# EAGLE schematic TestBoard (EAGLE 9.1.3)
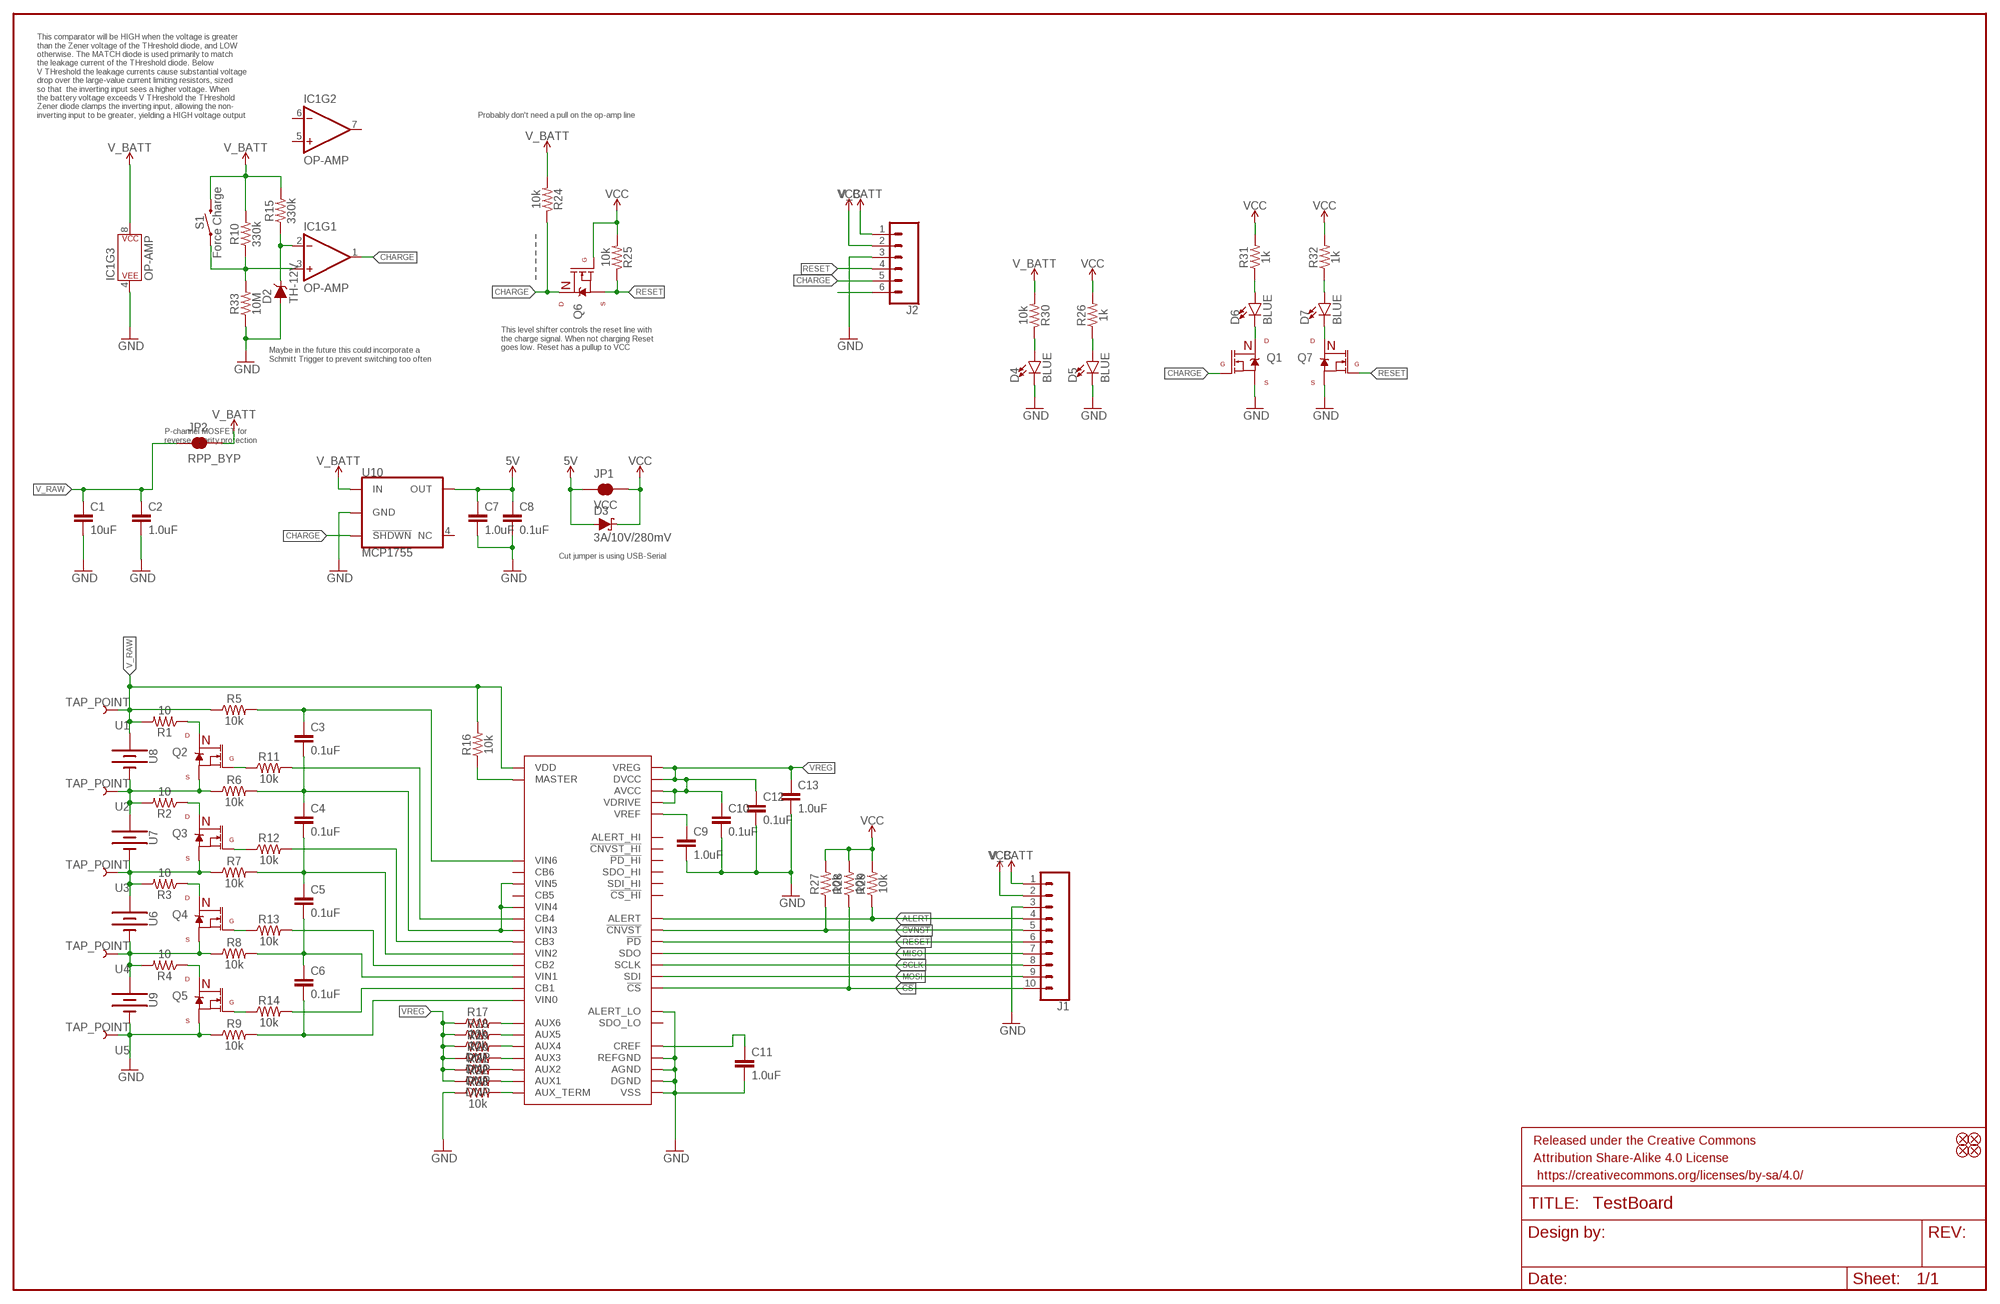
[diagram p0: schematic, sheet 1]

## Parts
C1  10uF  10UF-1210-50V-20%  [1210]
C2  1.0uF  1.0UF-1206-50V-10%  [1206]
C3  0.1uF  0.1UF-0603-25V-5%  [0603]
C4  0.1uF  0.1UF-0603-25V-5%  [0603]
C5  0.1uF  0.1UF-0603-25V-5%  [0603]
C6  0.1uF  0.1UF-0603-25V-5%  [0603]
C7  1.0uF  1.0UF-0603-16V-10%-X7R  [0603]
C8  0.1uF  0.1UF-0603-25V-5%  [0603]
C9  1.0uF  1.0UF-0603-16V-10%-X7R  [0603]
C10  0.1uF  0.1UF-0603-25V-5%  [0603]
C11  1.0uF  1.0UF-0603-16V-10%-X7R  [0603]
C12  0.1uF  0.1UF-0603-25V-5%  [0603]
C13  1.0uF  1.0UF-0603-16V-10%-X7R  [0603]
D2  TH-12V  DIODE-ZENER-MMBZ5233BLT1G  [SOT23-3]
D3  3A/10V/280mV  DIODE-SCHOTTKY-BAT60A  [SOD-323]
D4  BLUE  LED-BLUE0603  [LED-0603]
D5  BLUE  LED-BLUE0603  [LED-0603]
D6  BLUE  LED-BLUE0603  [LED-0603]
D7  BLUE  LED-BLUE0603  [LED-0603]
FD1  FIDUCIALUFIDUCIAL  [FIDUCIAL-MICRO]
FD2  FIDUCIALUFIDUCIAL  [FIDUCIAL-MICRO]
FD3  FIDUCIALUFIDUCIAL  [FIDUCIAL-MICRO]
FD4  FIDUCIALUFIDUCIAL  [FIDUCIAL-MICRO]
FRAME1  FRAME-LEDGER  [CREATIVE_COMMONS]
IC1  OP-AMP  OPAMP-DUALU  [SO08]
J1  CONN_10NO_SILK_PTH_FEMALE  [1X10_NO_SILK]
J2  CONN_06NO_SILK_NO_POP  [1X06_NO_SILK]
JP1  VCC  JUMPER-SMT_2_NC_TRACE_SILK  [SMT-JUMPER_2_NC_TRACE_SILK]
JP2  RPP_BYP  JUMPER-SMT_2_NC_TRACE_SILK  [SMT-JUMPER_2_NC_TRACE_SILK]
Q1  AMP_MOSFET_NCH-2N7002K  [SOT23-3]
Q2  AMP_MOSFET_NCH-2N7002K  [SOT23-3]
Q3  AMP_MOSFET_NCH-2N7002K  [SOT23-3]
Q4  AMP_MOSFET_NCH-2N7002K  [SOT23-3]
Q5  AMP_MOSFET_NCH-2N7002K  [SOT23-3]
Q6  AMP_MOSFET_NCH-2N7002K  [SOT23-3]
Q7  AMP_MOSFET_NCH-2N7002K  [SOT23-3]
R1  10  10OHM-1206-1/4W-1%  [1206]
R2  10  10OHM-1206-1/4W-1%  [1206]
R3  10  10OHM-1206-1/4W-1%  [1206]
R4  10  10OHM-1206-1/4W-1%  [1206]
R5  10k  10KOHM-0603-1/10W-1%  [0603]
R6  10k  10KOHM-0603-1/10W-1%  [0603]
R7  10k  10KOHM-0603-1/10W-1%  [0603]
R8  10k  10KOHM-0603-1/10W-1%  [0603]
R9  10k  10KOHM-0603-1/10W-1%  [0603]
R10  330k  330KOHM-0603-1/10W-1%  [0603]
R11  10k  10KOHM-0603-1/10W-1%  [0603]
R12  10k  10KOHM-0603-1/10W-1%  [0603]
R13  10k  10KOHM-0603-1/10W-1%  [0603]
R14  10k  10KOHM-0603-1/10W-1%  [0603]
R15  330k  330KOHM-0603-1/10W-1%  [0603]
R16  10k  10KOHM-0603-1/10W-1%  [0603]
R17  10k  10KOHM-0603-1/10W-1%  [0603]
R18  10k  10KOHM-0603-1/10W-1%  [0603]
R19  DNP  NTC_STOP_ONE_SIDE  [AXIAL-0.3]
R20  DNP  NTC_STOP_ONE_SIDE  [AXIAL-0.3]
R21  DNP  NTC_STOP_ONE_SIDE  [AXIAL-0.3]
R22  DNP  NTC_STOP_ONE_SIDE  [AXIAL-0.3]
R23  10k  10KOHM-0603-1/10W-1%  [0603]
R24  10k  10KOHM-0603-1/10W-1%  [0603]
R25  10k  10KOHM-0603-1/10W-1%  [0603]
R26  1k  1KOHM-0603-1/10W-1%  [0603]
R27  10k  10KOHM-0603-1/10W-1%  [0603]
R28  10k  10KOHM-0603-1/10W-1%  [0603]
R29  10k  10KOHM-0603-1/10W-1%  [0603]
R30  10k  10KOHM-0603-1/10W-1%  [0603]
R31  1k  1KOHM-0603-1/10W-1%  [0603]
R32  1k  1KOHM-0603-1/10W-1%  [0603]
R33  10M  10MOHM-0603-1/10W-5%  [0603]
S1  Force Charge  MOMENTARY-SWITCH-SPST-SMD-5.2-TALL-REDUNDANT  [TACTILE_SWITCH_SMD_5.2MM]
U1  TAP_POINT  [1X01_SMD_0.1IN]
U2  TAP_POINT  [1X01_SMD_0.1IN]
U3  TAP_POINT  [1X01_SMD_0.1IN]
U4  TAP_POINT  [1X01_SMD_0.1IN]
U5  TAP_POINT  [1X01_SMD_0.1IN]
U6  SINGLECELL  (no package)
U7  SINGLECELL  (no package)
U8  SINGLECELL  (no package)
U9  SINGLECELL  (no package)
U10  MCP1755  [SOT23-5]
U11  AD7280A  [LQFP-48]

## Nets
5V: C7.1 C8.1 D3.A JP1.1 U10.5(OUT)
!CS: J1.10 R28.1 U11.21(!CS)
!CVNST: J1.5 R27.1 U11.24(!CNVST)
ALERT: J1.4 R29.1 U11.27(ALERT)
CHARGE: IC1.1(OUT) J2.5 Q1.1(G) Q6.3(D) R24.1 U10.3(!SHDWN)
GND: C1.2 C2.2 C7.2 C8.2 C9.2 C10.2 C11.2 C12.2 C13.2 D2.1(A) D4.C D5.C IC1.4(P$V-) J1.3 J2.3 Q1.2(S) Q5.2(S) Q7.2(S) R9.1 R23.1 R33.1 U5.1 U9.- U10.2(GND) U11.17(VSS) U11.20(DGND) U11.28(ALERT_LO) U11.31(AGND) U11.41(REFGND)
MISO: J1.7 U11.26(SDO)
MOSI: J1.9 U11.23(SDI)
N$2: D7.C Q7.3(D)
N$3: D6.C Q1.3(D)
N$5: Q2.3(D) R1.1
N$6: Q2.2(S) R2.2 R6.1 U2.1 U7.+ U8.-
N$7: Q3.3(D) R2.1
N$8: Q3.2(S) R3.2 R7.1 U3.1 U6.+ U7.-
N$9: Q4.3(D) R3.1
N$10: Q4.2(S) R4.2 R8.1 U4.1 U6.- U9.+
N$11: Q5.3(D) R4.1
N$12: Q2.1(G) R11.1
N$13: Q3.1(G) R12.1
N$14: R16.1 U11.14(MASTER)
N$15: Q4.1(G) R13.1
N$16: Q5.1(G) R14.1
N$17: C6.2 R9.2 U11.13(VIN0)
N$18: R14.2 U11.12(CB1)
N$19: C5.2 C6.1 R8.2 U11.11(VIN1)
N$20: R13.2 U11.10(CB2)
N$21: C4.2 C5.1 R7.2 U11.9(VIN2)
N$22: R12.2 U11.8(CB3)
N$23: R22.P$2 U11.38(AUX1)
N$24: R11.2 U11.6(CB4)
N$25: C3.1 R5.2 U11.1(VIN6)
N$26: C3.2 C4.1 R6.2 U11.3(VIN5) U11.5(VIN4) U11.7(VIN3)
N$27: C9.1 U11.40(VREF)
N$28: R17.2 U11.33(AUX6)
N$29: C11.1 U11.39(CREF)
N$30: R23.2 U11.32(AUX_TERM)
N$31: R18.2 U11.34(AUX5)
N$32: R21.P$2 U11.37(AUX2)
N$33: R20.P$2 U11.36(AUX3)
N$34: R19.P$2 U11.35(AUX4)
N$35: D4.A R30.1
N$36: J2.6
N$37: D5.A R26.1
N$38: D6.A R31.1
N$39: D7.A R32.1
N$40: IC1.3(+IN) R10.1 R33.2 S1.1 S1.2
N$41: D2.3(C) IC1.2(-IN) R15.1
RESET: J1.6 J2.4 Q6.2(S) Q7.1(G) R25.1 U11.15(!PD)
SCLK: J1.8 U11.22(SCLK)
V_BATT: IC1.8(P$V+) J1.1 J2.1 JP2.2 R10.2 R15.2 R24.2 R30.2 S1.3 S1.4 U10.1(IN)
V_RAW: C1.1 C2.1 JP2.1 R1.2 R5.1 R16.2 U1.1 U8.+ U11.16(VDD)
VCC: D3.C J1.2 J2.2 JP1.2 Q6.1(G) R25.2 R26.2 R27.2 R28.2 R29.2 R31.2 R32.2
VREG: C10.1 C12.1 C13.1 R17.1 R18.1 R19.P$1 R20.P$1 R21.P$1 R22.P$1 U11.18(VREG) U11.19(DVCC) U11.29(VDRIVE) U11.30(AVCC)
Unconnected: IC1.5(+IN) IC1.6(-IN) IC1.7(OUT) U10.4(NC) U11.2(CB6) U11.4(CB5) U11.25(SDO_LO) U11.42(ALERT_HI) U11.43(SDI_HI) U11.44(!CNVST_HI) U11.45(SDO_HI) U11.46(!CS_HI) U11.47(!PD_HI)

## Notes on the sheet
- This comparator will be HIGH when the voltage is greater
  than the Zener voltage of the THreshold diode, and LOW 
  otherwise. The MATCH diode is used primarily to match
  the leakage current of the THreshold diode. Below 
  V THreshold the leakage currents cause substantial voltage 
  drop over the large-value current limiting resistors, sized 
  so that  the inverting input sees a higher voltage. When 
  the battery voltage exceeds V THreshold the THreshold
  Zener diode clamps the inverting input, allowing the non-
  inverting input to be greater, yielding a HIGH voltage output
- Probably don't need a pull on the op-amp line
- This level shifter controls the reset line with
  the charge signal. When not charging Reset
  goes low. Reset has a pullup to VCC
- Maybe in the future this could incorporate a 
  Schmitt Trigger to prevent switching too often
- P-channel MOSFET for 
  reverse polarity protection
- Cut jumper is using USB-Serial

## Library data of the parts
C1 = SparkFun-Capacitors:10UF: 10.0µF ceramic capacitors A capacitor is a passive two-terminal electrical component used to store electrical energy temporarily in an electric field.; PROD_ID: CAP-09824
C2 = SparkFun-Capacitors:1.0UF: 1µF ceramic capacitors A capacitor is a passive two-terminal electrical component used to store electrical energy temporarily in an electric field.; PROD_ID: CAP-09822
C3-C6 C8 C10 C12 = SparkFun-Capacitors:0.1UF: 0.1µF ceramic capacitors A capacitor is a passive two-terminal electrical component used to store electrical energy temporarily in an electric field.; PROD_ID: CAP-08604
C7 C9 C11 C13 = SparkFun-Capacitors:1.0UF: 1µF ceramic capacitors A capacitor is a passive two-terminal electrical component used to store electrical energy temporarily in an electric field.; PROD_ID: CAP-13930
D2 = SparkFun-DiscreteSemi:DIODE-ZENER: Zener Diode A Zener diode allows current to flow from its anode to its cathode like a normal semiconductor diode, but it also permits current to flow in the reverse direction when its "Zener voltage" is reached. - WIkipedia; PROD_ID: DIO-14123; VALUE: 6V
D3 = SparkFun-DiscreteSemi:DIODE-SCHOTTKY: Schottky diode A Schottky diode is a semiconductor diode which has a low forward voltage drop and a very fast switching action.; PROD_ID: DIO-14072
D4-D7 = SparkFun-LED:LED-BLUE: Blue SMD LED Used in manufacturing of various products at SparkFun Packages: 0603 - SMD 0603 package [Product Link] <http://www.digikey.com/product-detail/en/SMLE12BC7TT86/511-1589-2-ND/1641808> 1206 - SMD1206 package [Product Link] <http://www.digikey.com/product-detail/en/lite-on-inc/LTST-C150TBKT/160-1643-1-ND/573584> SparkFun Products: ESP8266 Thing-Dev Board <https://www.sparkfun.com/products/13711> RedBoard <https://www.sparkfun.com/products/12757>; PROD_ID: DIO-08575
FD1-FD4 = SparkFun-Aesthetics:FIDUCIAL: Fiducial Alignment Points Point-of-reference for pick-and-place machines and other optical instruments.
FRAME1 = SparkFun-Aesthetics:FRAME-LEDGER: Schematic Frame - Ledger Standard 11x14 US Ledger frame
IC1 = SparkFun-IC-Amplifiers:OPAMP-DUAL: Generic op-amp footprint This component is for the standard 358 pinning of a dual op-amp From the LM358 datasheet: Pin 1: Output A Pin 2: Inverting Input A Pin 3: Non-Inverting Input A Pin 4: Gnd Pin 5: Non-Inverting Input B Pin 6: Inverting Input B Pin 7: Output B Pin 8: V+; PROD_ID: NA-XXXXX
J1 = SparkFun-Connectors:CONN_10: Multi connection point. Often used as Generic Header-pin footprint for 0.1 inch spaced/style header connections On any of the 0.1 inch spaced packages, you can populate with these: Break Away Headers - Straight <https://www.sparkfun.com/products/116> (PRT-00116) Break Away Male Headers - Right Angle <https://www.sparkfun.com/products/553> (PRT-00553) Female Headers <https://www.sparkfun.com/products/115> (PRT-00115) Break Away Headers - Machine Pin <https://www.sparkfun.com/products/117> (PRT-00117) Break Away Female Headers - Swiss Machine Pin <https://www.sparkfun.com/products/743> (PRT-00743) Arduino Stackable Header - 10 Pin <https://www.sparkfun.com/products/11376> (PRT-11376) For SCREWTERMINALS and SPRING TERMINALS visit here: Screw Terimnals on SparkFun.com <https://www.sparkfun.com/search/results?term=Screw+Terminals> (5mm/3.5mm/2.54mm spacing) This device is also useful as a general connection point to wire up your design to another part of your project. Our various solder wires solder well into these plated through hole pads. Hook-Up Wire - Assortment (Stranded, 22 AWG) <https://www.sparkfun.com/products/11375> (PRT-11375) Hook-Up Wire - Assortment (Solid Core, 22 AWG) <https://www.sparkfun.com/products/11367> (PRT-11367) View the entire wire category on our website here <https://www.sparkfun.com/categories/141> Special notes: Molex polarized connector foot print use with SKU : PRT-08231 with associated crimp pins and housings. 1MM SMD Version SKU: PRT-10208 NOTES ON THE VARIANTS LOCK and LOCK_LONGPADS... This footprint was designed to help hold the alignment of a through-hole component (i.e. 6-pin header) while soldering it into place. You may notice that each hole has been shifted either up or down by 0.005 of an inch from it's more standard position (which is a perfectly straight line). This slight alteration caused the pins (the squares in the middle) to touch the edges of the holes. Because they are alternating, it causes a "brace" to hold the component in place. 0.005 has proven to be the perfect amount of "off-center" position when using our standard breakaway headers. Although looks a little odd when you look at the bare footprint, once you have a header in there, the alteration is very hard to notice. Also,if you push a header all the way into place, it is covered up entirely on the bottom side.; PROD_ID: CONN-11563
J2 = SparkFun-Connectors:CONN_06: Multi connection point. Often used as Generic Header-pin footprint for 0.1 inch spaced/style header connections On any of the 0.1 inch spaced packages, you can populate with these: Break Away Headers - Straight <https://www.sparkfun.com/products/116> (PRT-00116) Break Away Male Headers - Right Angle <https://www.sparkfun.com/products/553> (PRT-00553) Female Headers <https://www.sparkfun.com/products/115> (PRT-00115) Break Away Headers - Machine Pin <https://www.sparkfun.com/products/117> (PRT-00117) Break Away Female Headers - Swiss Machine Pin <https://www.sparkfun.com/products/743> (PRT-00743) Arduino Stackable Header - 6 Pin <https://www.sparkfun.com/products/9280> (PRT-09280) For SCREWTERMINALS and SPRING TERMINALS visit here: Screw Terimnals on SparkFun.com <https://www.sparkfun.com/search/results?term=Screw+Terminals> (5mm/3.5mm/2.54mm spacing) This device is also useful as a general connection point to wire up your design to another part of your project. Our various solder wires solder well into these plated through hole pads. Hook-Up Wire - Assortment (Stranded, 22 AWG) <https://www.sparkfun.com/products/11375> (PRT-11375) Hook-Up Wire - Assortment (Solid Core, 22 AWG) <https://www.sparkfun.com/products/11367> (PRT-11367) View the entire wire category on our website here <https://www.sparkfun.com/categories/141>
JP1 JP2 = SparkFun-Jumpers:JUMPER-SMT_2_NC_TRACE: Normally closed trace jumper This jumper has a trace between two pads so it's normally closed (NC). Use a razor knife to open the connection. For best results follow the IPC guidelines for cutting traces: Cutout at least 0.063 mm (0.005 in). Remove all loose material to clean up the cut area. Seal the cut with an approved epoxy. Reapply solder to reclose the connection.
Q1-Q7 = MTAES_V2_UniqueParts:AMP_MOSFET_NCH
R1-R4 = SparkFun-Resistors:10OHM: 10Ω resistor A resistor is a passive two-terminal electrical component that implements electrical resistance as a circuit element. Resistors act to reduce current flow, and, at the same time, act to lower voltage levels within circuits. - Wikipedia; PROD_ID: RES-08705
R5-R9 R11-R14 R16-R18 R23-R25 R27-R30 = SparkFun-Resistors:10KOHM: 10kΩ resistor A resistor is a passive two-terminal electrical component that implements electrical resistance as a circuit element. Resistors act to reduce current flow, and, at the same time, act to lower voltage levels within circuits. - Wikipedia; PROD_ID: RES-00824
R10 R15 = SparkFun-Resistors:330KOHM: 330kΩ resistor A resistor is a passive two-terminal electrical component that implements electrical resistance as a circuit element. Resistors act to reduce current flow, and, at the same time, act to lower voltage levels within circuits. - Wikipedia; PROD_ID: RES-08968
R19-R22 = BBLib:NTC_STOP_ONE_SIDE
R26 R31 R32 = SparkFun-Resistors:1KOHM: 1kΩ resistor A resistor is a passive two-terminal electrical component that implements electrical resistance as a circuit element. Resistors act to reduce current flow, and, at the same time, act to lower voltage levels within circuits. - Wikipedia; PROD_ID: RES-07856
R33 = SparkFun-Resistors:10MOHM: RES-09327; PROD_ID: RES-08283
S1 = SparkFun-Switches:MOMENTARY-SWITCH-SPST: Momentary Switch (Pushbutton) - SPST Normally-open (NO) SPST momentary switches (buttons, pushbuttons). Variants PTH-12MM - 12mm square, through-hole Momentary Pushbutton Switch - 12mm Square <https://www.sparkfun.com/products/9190> (COM-09190) PTH-6.0MM, PTH-6.0MM-KIT - 6.0mm square, through-hole Mini Pushbutton Switch <https://www.sparkfun.com/products/97> (COM-00097) KIT package intended for soldering kit's - only one side of pads' copper is exposed. PTH-RIGHT-ANGLE-KIT - Right-angle, through-hole Right Angle Tactile Button <https://www.sparkfun.com/products/10791> - Used on SparkFun BigTime Watch Kit <https://www.sparkfun.com/products/11734> SMD-12MM - 12mm square, surface-mount Tactile Button - SMD (12mm) <https://www.sparkfun.com/products/12993> (COM-12993) Used on SparkFun PicoBoard <https://www.sparkfun.com/products/11888> SMD-4.5MM - 4.5mm Square Trackball Switch Used on SparkFun Blackberry Trackballer Breakout <https://www.sparkfun.com/products/13169> SMD-4.6MMX2.8MM - 4.60mm x 2.80mm, surface mount Used on SparkFun SAMD21 Mini Breakout <https://www.sparkfun.com/products/13664> SMD-5.2MM, SMD-5.2-REDUNDANT - 5.2mm square, surface-mount Mini Pushbutton Switch - SMD <https://www.sparkfun.com/products/8720> (COM-08720) Used on Arduino Pro Mini <https://www.sparkfun.com/products/11114> REDUNDANT package connects both switch circuits together SMD-6.0X3.5MM - 6.0 x 3.5mm, surface mount Momentary Reset Switch SMD <https://www.sparkfun.com/products/8229> (COM-08229) SMD-6.2MM-TALL - 6.2mm square, surface mount Tactile Button - SMD (6mm) <https://www.sparkfun.com/products/12992> Used on SparkFun Digital Sandbox <https://www.sparkfun.com/products/12651> SMD-RIGHT-ANGLE - Right-angle, surface mount Used on SparkFun Block for Intel® Edison - Arduino <https://www.sparkfun.com/products/13036>; PROD_ID: SWCH-14139
U1-U5 = BBLib:TAP_POINT
U6-U9 = BBLib:SINGLECELL
U10 = BBLib:MCP1755
U11 = BBLib:AD7280A